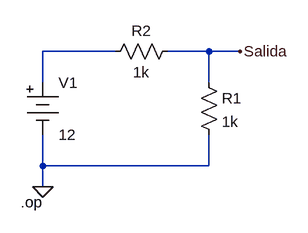
[diagram p0: schematic E1-captura.asc]
E1-captura.asc, the LTspice schematic file:
Version 4
SHEET 1 880 680
WIRE 192 80 80 80
WIRE 336 80 272 80
WIRE 384 80 336 80
WIRE 80 128 80 80
WIRE 336 128 336 80
WIRE 80 256 80 208
WIRE 336 256 336 208
WIRE 336 256 80 256
WIRE 80 288 80 256
FLAG 80 288 0
FLAG 384 80 Salida
DATAFLAG 368 80 ""
DATAFLAG 144 80 ""
DATAFLAG 240 256 ""
SYMBOL Misc\\battery 80 112 R0
WINDOW 123 0 0 Left 0
WINDOW 39 0 0 Left 0
SYMATTR InstName V1
SYMATTR Value 12
SYMBOL res 320 112 R0
SYMATTR InstName R1
SYMATTR Value 1k
SYMBOL res 288 64 R90
WINDOW 0 0 56 VBottom 2
WINDOW 3 32 56 VTop 2
SYMATTR InstName R2
SYMATTR Value 1k
TEXT 46 312 Left 2 !.op

The netlist it stands for:
* E1-captura.asc
V1 N001 0 12
R1 Salida 0 1k
R2 Salida N001 1k
.op
.backanno
.end